# Altium schematic sheet Sensors.SchDoc
size Letter; SheetNumber: 3; SheetTotal: 4
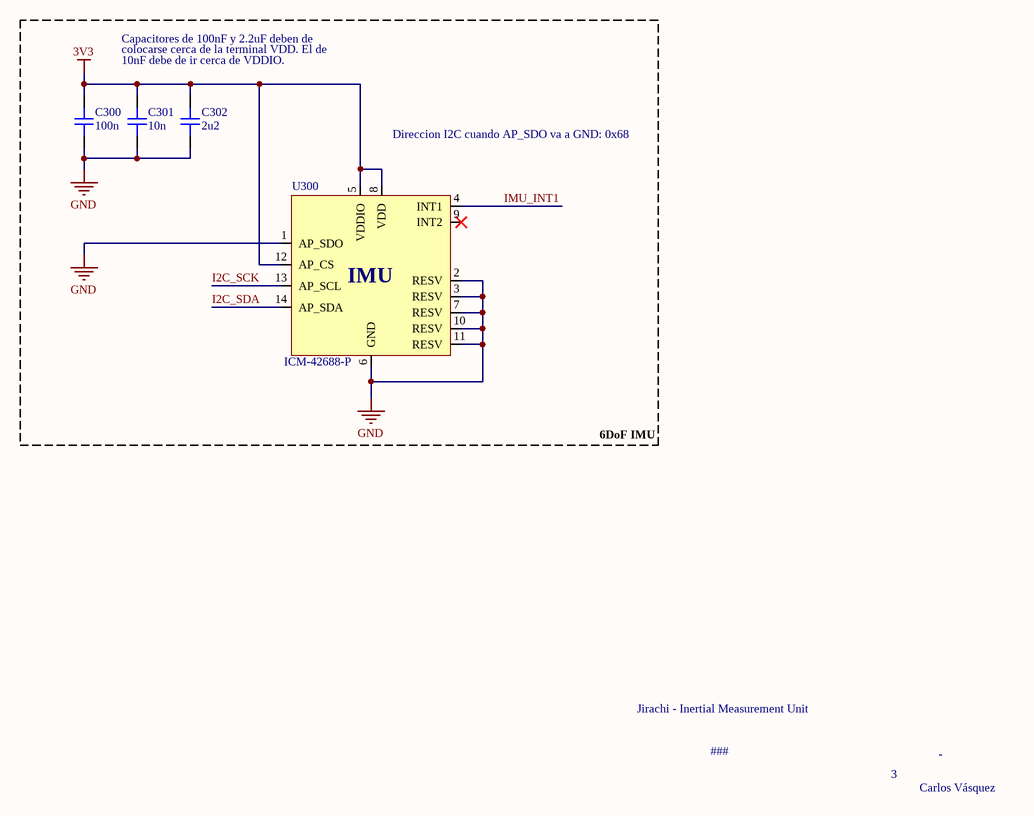
[diagram p0: Sensors.SchDoc]

## Parts
C300  100n  [CAP_0402]
C301  10n  [CAP_0402]
C302  2u2  [CAP_0402]
U300  ICM-42688-P  [LGA14 (2.5mm x 3mm)]

## Nets
3V3: C300.2 C301.2 C302.2 U300.5(VDDIO) U300.8(VDD) U300.12(AP_CS)
GND: C300.1 C301.1 C302.1 U300.1(AP_SDO) U300.2(RESV) U300.3(RESV) U300.6(GND) U300.7(RESV) U300.10(RESV) U300.11(RESV)
I2C_SCK: U300.13(AP_SCL)
I2C_SDA: U300.14(AP_SDA)
IMU_INT1: U300.4(INT1)

Not connected (* = marked no-connect by the designer): U300 9(INT2)*

## Notes on the sheet
- Capacitores de 100nF y 2.2uF deben de
- colocarse cerca de la terminal VDD. El de
- 10nF debe de ir cerca de VDDIO.
- (near U300) Direccion I2C cuando AP_SDO va a GND: 0x68
- 6DoF IMU
- Jirachi - Inertial Measurement Unit
- ###
- 3
- -
- Carlos Vásquez
- (in symbol ICM-42688-P) IMU

## Library data of the parts
C300-C302 = CAP_0402: Capacitor SMD 0402; Manufacturer: *; Manufacturer Part Number: *; Distributor Link: *; LCSC: *; Rating: *; Dielectric: *
U300 = ICM-42688-P: 6-axis MEMS IMU (Accelerometer & Gyroscope)